# Altium schematic sheet Schematic_1_2026-10-04.schdoc
size 84 x 97 mm
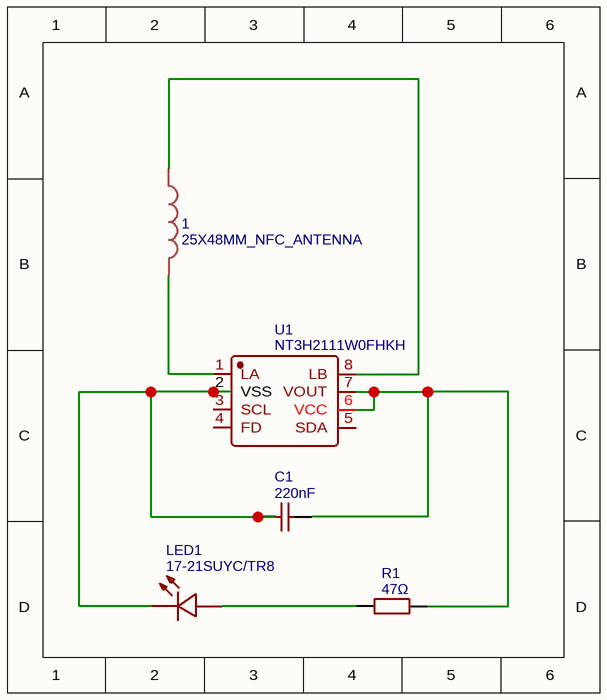
[diagram p0: Schematic_1_2026-10-04.schdoc]

## Parts
1  25X48MM_NFC_ANTENNA  [25X48MM_NFC_ANTENNA]
C1  220nF  [C0603]
LED1  17-21SUYC/TR8  [LED0805-R-RD]
R1  47Ω  [R0603]
U1  NT3H2111W0FHKH  [XQFN-8_L1.6-W1.6-P0.50-BL_NT3H2111W0FHKH]

## Nets
Net1_P$1: 1.P$1 U1.8(LB)
Net1_P$2: 1.P$2 U1.1(LA)
NetC1_1: C1.1 LED1.2(-) U1.2(VSS)
NetC1_2: C1.2 R1.2 U1.6(VCC) U1.7(VOUT)
NetLED1_1: LED1.1(+) R1.1

Not connected (* = marked no-connect by the designer): U1 3(SCL) 4(FD) 5(SDA)

## Library data of the parts
1 = 25X48MM_NFC_ANTENNA: Contributor: maggie.j.liu; spicePre: ?; spiceSymbolName: 25X48MM_NFC_ANTENNA
C1 = 220nF: Manufacturer Part: CL10B224KA8NNNC; Manufacturer: SAMSUNG(三星); nameAlias: Value; Supplier: LCSC; Supplier Part: C21120; JLCPCB Part Class: Basic Part; spicePre: C; spiceSymbolName: CL10B224KA8NNNC
LED1 = 17-21SUYC/TR8: Manufacturer: KENTO; Manufacturer Part: KT-0805黄灯; Supplier: LCSC; Supplier Part: C2296; JLCPCB Part Class: Basic Part; spicePre: L; spiceSymbolName: 17-21SUYC/TR8
R1 = 47Ω: Manufacturer: UNI-ROYAL(厚声); Manufacturer Part: 0603WAF470JT5E; nameAlias: Value; Supplier: LCSC; Supplier Part: C23182; JLCPCB Part Class: Basic Part; spicePre: R; spiceSymbolName: 0603WAF470JT5E
U1 = NT3H2111W0FHKH: Manufacturer: NXP(恩智浦); Contributor: LCSC; Supplier: LCSC; Supplier Part: C710403; Manufacturer Part: NT3H2111W0FHKH; JLCPCB Part Class: Extended Part; spicePre: U; spiceSymbolName: NT3H2111W0FHKH